# EAGLE schematic JTAG Passthrough (EAGLE 6.5.0)
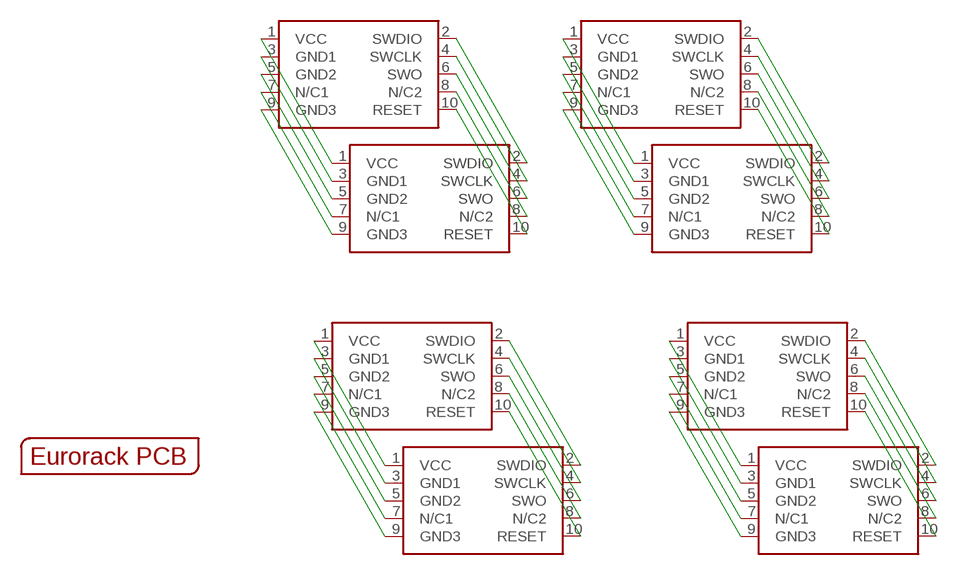
[diagram p0: schematic, sheet 1]

## Parts
SWD1  CORTEX_SWD  [M50-3600542]
SWD2  CORTEX_SWDVERT_HOLE  [SWD_VERTICAL_WITHHOLE]
SWD3  CORTEX_SWD  [M50-3600542]
SWD4  CORTEX_SWDVERT_HOLE  [SWD_VERTICAL_WITHHOLE]
SWD5  CORTEX_SWD  [M50-3600542]
SWD6  CORTEX_SWDVERT_HOLE  [SWD_VERTICAL_WITHHOLE]
SWD7  CORTEX_SWD  [M50-3600542]
SWD8  CORTEX_SWDVERT_HOLE  [SWD_VERTICAL_WITHHOLE]
U$2  EURORACK_PCB2HP  [EURORACK2HPPCB]

## Nets
N$1: SWD1.1(VCC) SWD2.1(VCC)
N$2: SWD1.2(SWDIO) SWD2.2(SWDIO)
N$3: SWD1.3(GND1) SWD2.3(GND1)
N$4: SWD1.4(SWCLK) SWD2.4(SWCLK)
N$5: SWD1.5(GND2) SWD2.5(GND2)
N$6: SWD1.6(SWO) SWD2.6(SWO)
N$7: SWD1.7(N/C1) SWD2.7(N/C1)
N$8: SWD1.8(N/C2) SWD2.8(N/C2)
N$9: SWD1.9(GND3) SWD2.9(GND3)
N$10: SWD1.10(RESET) SWD2.10(RESET)
N$11: SWD3.1(VCC) SWD4.1(VCC)
N$12: SWD3.2(SWDIO) SWD4.2(SWDIO)
N$13: SWD3.3(GND1) SWD4.3(GND1)
N$14: SWD3.4(SWCLK) SWD4.4(SWCLK)
N$15: SWD3.5(GND2) SWD4.5(GND2)
N$16: SWD3.6(SWO) SWD4.6(SWO)
N$17: SWD3.7(N/C1) SWD4.7(N/C1)
N$18: SWD3.8(N/C2) SWD4.8(N/C2)
N$19: SWD3.9(GND3) SWD4.9(GND3)
N$20: SWD3.10(RESET) SWD4.10(RESET)
N$21: SWD5.1(VCC) SWD6.1(VCC)
N$22: SWD5.2(SWDIO) SWD6.2(SWDIO)
N$23: SWD5.3(GND1) SWD6.3(GND1)
N$24: SWD5.4(SWCLK) SWD6.4(SWCLK)
N$25: SWD5.5(GND2) SWD6.5(GND2)
N$26: SWD5.6(SWO) SWD6.6(SWO)
N$27: SWD5.7(N/C1) SWD6.7(N/C1)
N$28: SWD5.8(N/C2) SWD6.8(N/C2)
N$29: SWD5.9(GND3) SWD6.9(GND3)
N$30: SWD5.10(RESET) SWD6.10(RESET)
N$31: SWD7.1(VCC) SWD8.1(VCC)
N$32: SWD7.2(SWDIO) SWD8.2(SWDIO)
N$33: SWD7.3(GND1) SWD8.3(GND1)
N$34: SWD7.4(SWCLK) SWD8.4(SWCLK)
N$35: SWD7.5(GND2) SWD8.5(GND2)
N$36: SWD7.6(SWO) SWD8.6(SWO)
N$37: SWD7.7(N/C1) SWD8.7(N/C1)
N$38: SWD7.8(N/C2) SWD8.8(N/C2)
N$39: SWD7.9(GND3) SWD8.9(GND3)
N$40: SWD7.10(RESET) SWD8.10(RESET)

## Library data of the parts
SWD1-SWD8 = carrilib with jtags:CORTEX_SWD: .05" Cortex M Connector in SWD mode Manufacturer: Generic Part Number: Cortex M SWD Notes: I use Harwin M50-3600542 connectors
U$2 = EurorackModularParts:EURORACK_PCB